# EAGLE schematic BareBones (EAGLE 7.6.0)
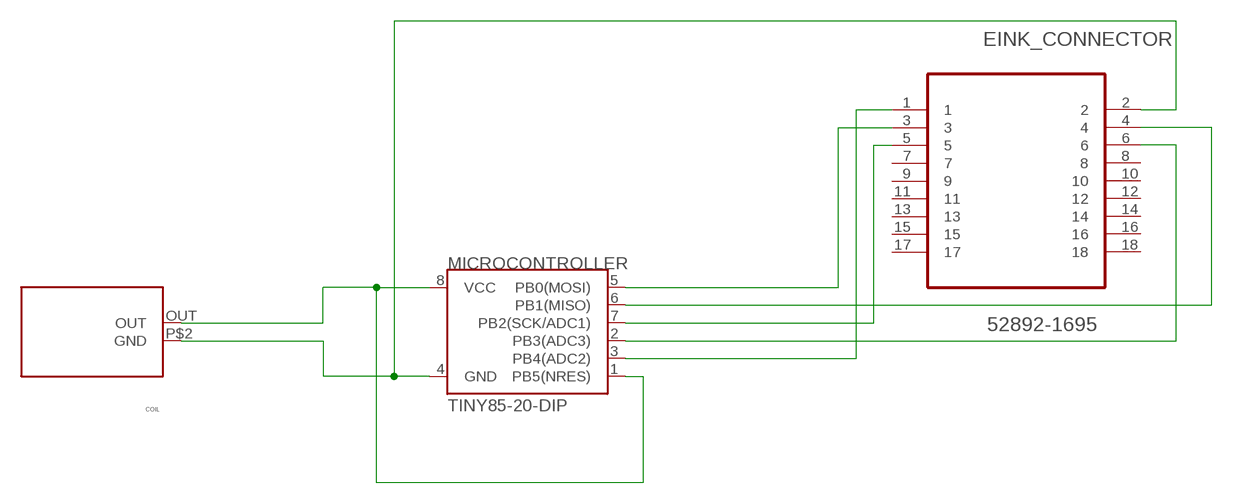
[diagram p0: schematic, sheet 1]

## Parts
COIL  P9027LP-R  [P9027LP-R]
EINK_CONNECTOR  52892-1695  [MOLEX_52892-1695]
MICROCONTROLLER  TINY85-20-DIP  ATTINY45TINY85-20-DIP  [DIP08]

## Nets
GND: COIL.P$2(GND) EINK_CONNECTOR.2 MICROCONTROLLER.4(GND)
N$1: EINK_CONNECTOR.1 MICROCONTROLLER.3(PB4(ADC2))
N$2: EINK_CONNECTOR.6 MICROCONTROLLER.2(PB3(ADC3))
N$5: EINK_CONNECTOR.3 MICROCONTROLLER.5(PB0(MOSI))
N$6: EINK_CONNECTOR.4 MICROCONTROLLER.6(PB1(MISO))
N$7: EINK_CONNECTOR.5 MICROCONTROLLER.7(PB2(SCK/ADC1))
PWR: COIL.OUT MICROCONTROLLER.1(PB5(NRES)) MICROCONTROLLER.8(VCC)
Unconnected: EINK_CONNECTOR.7 EINK_CONNECTOR.8 EINK_CONNECTOR.9 EINK_CONNECTOR.10 EINK_CONNECTOR.11 EINK_CONNECTOR.12 EINK_CONNECTOR.13 EINK_CONNECTOR.14 EINK_CONNECTOR.15 EINK_CONNECTOR.16 EINK_CONNECTOR.17 EINK_CONNECTOR.18

## Library data of the parts
COIL = GeekAmmo:P9027LP-R
EINK_CONNECTOR = Molex_By_element14_Batch_1:52892-1695: CONNECTOR, FPC, ZIF, 0.50MM, 16 WAY; MPN: 52892-1695; OC_FARNELL: 1556807; OC_NEWARK: 92M6601; PACKAGE: CONNECTOR, FPC, ZIF, 0.50MM, 16 WAY; SUPPLIER: Molex
MICROCONTROLLER = SparkFun-DigitalIC:ATTINY45: Atmel 8-pin 2/4/8kB flash uC; PROD_ID: IC-09445